# EAGLE schematic picotouchsynth (EAGLE 9.6.2)
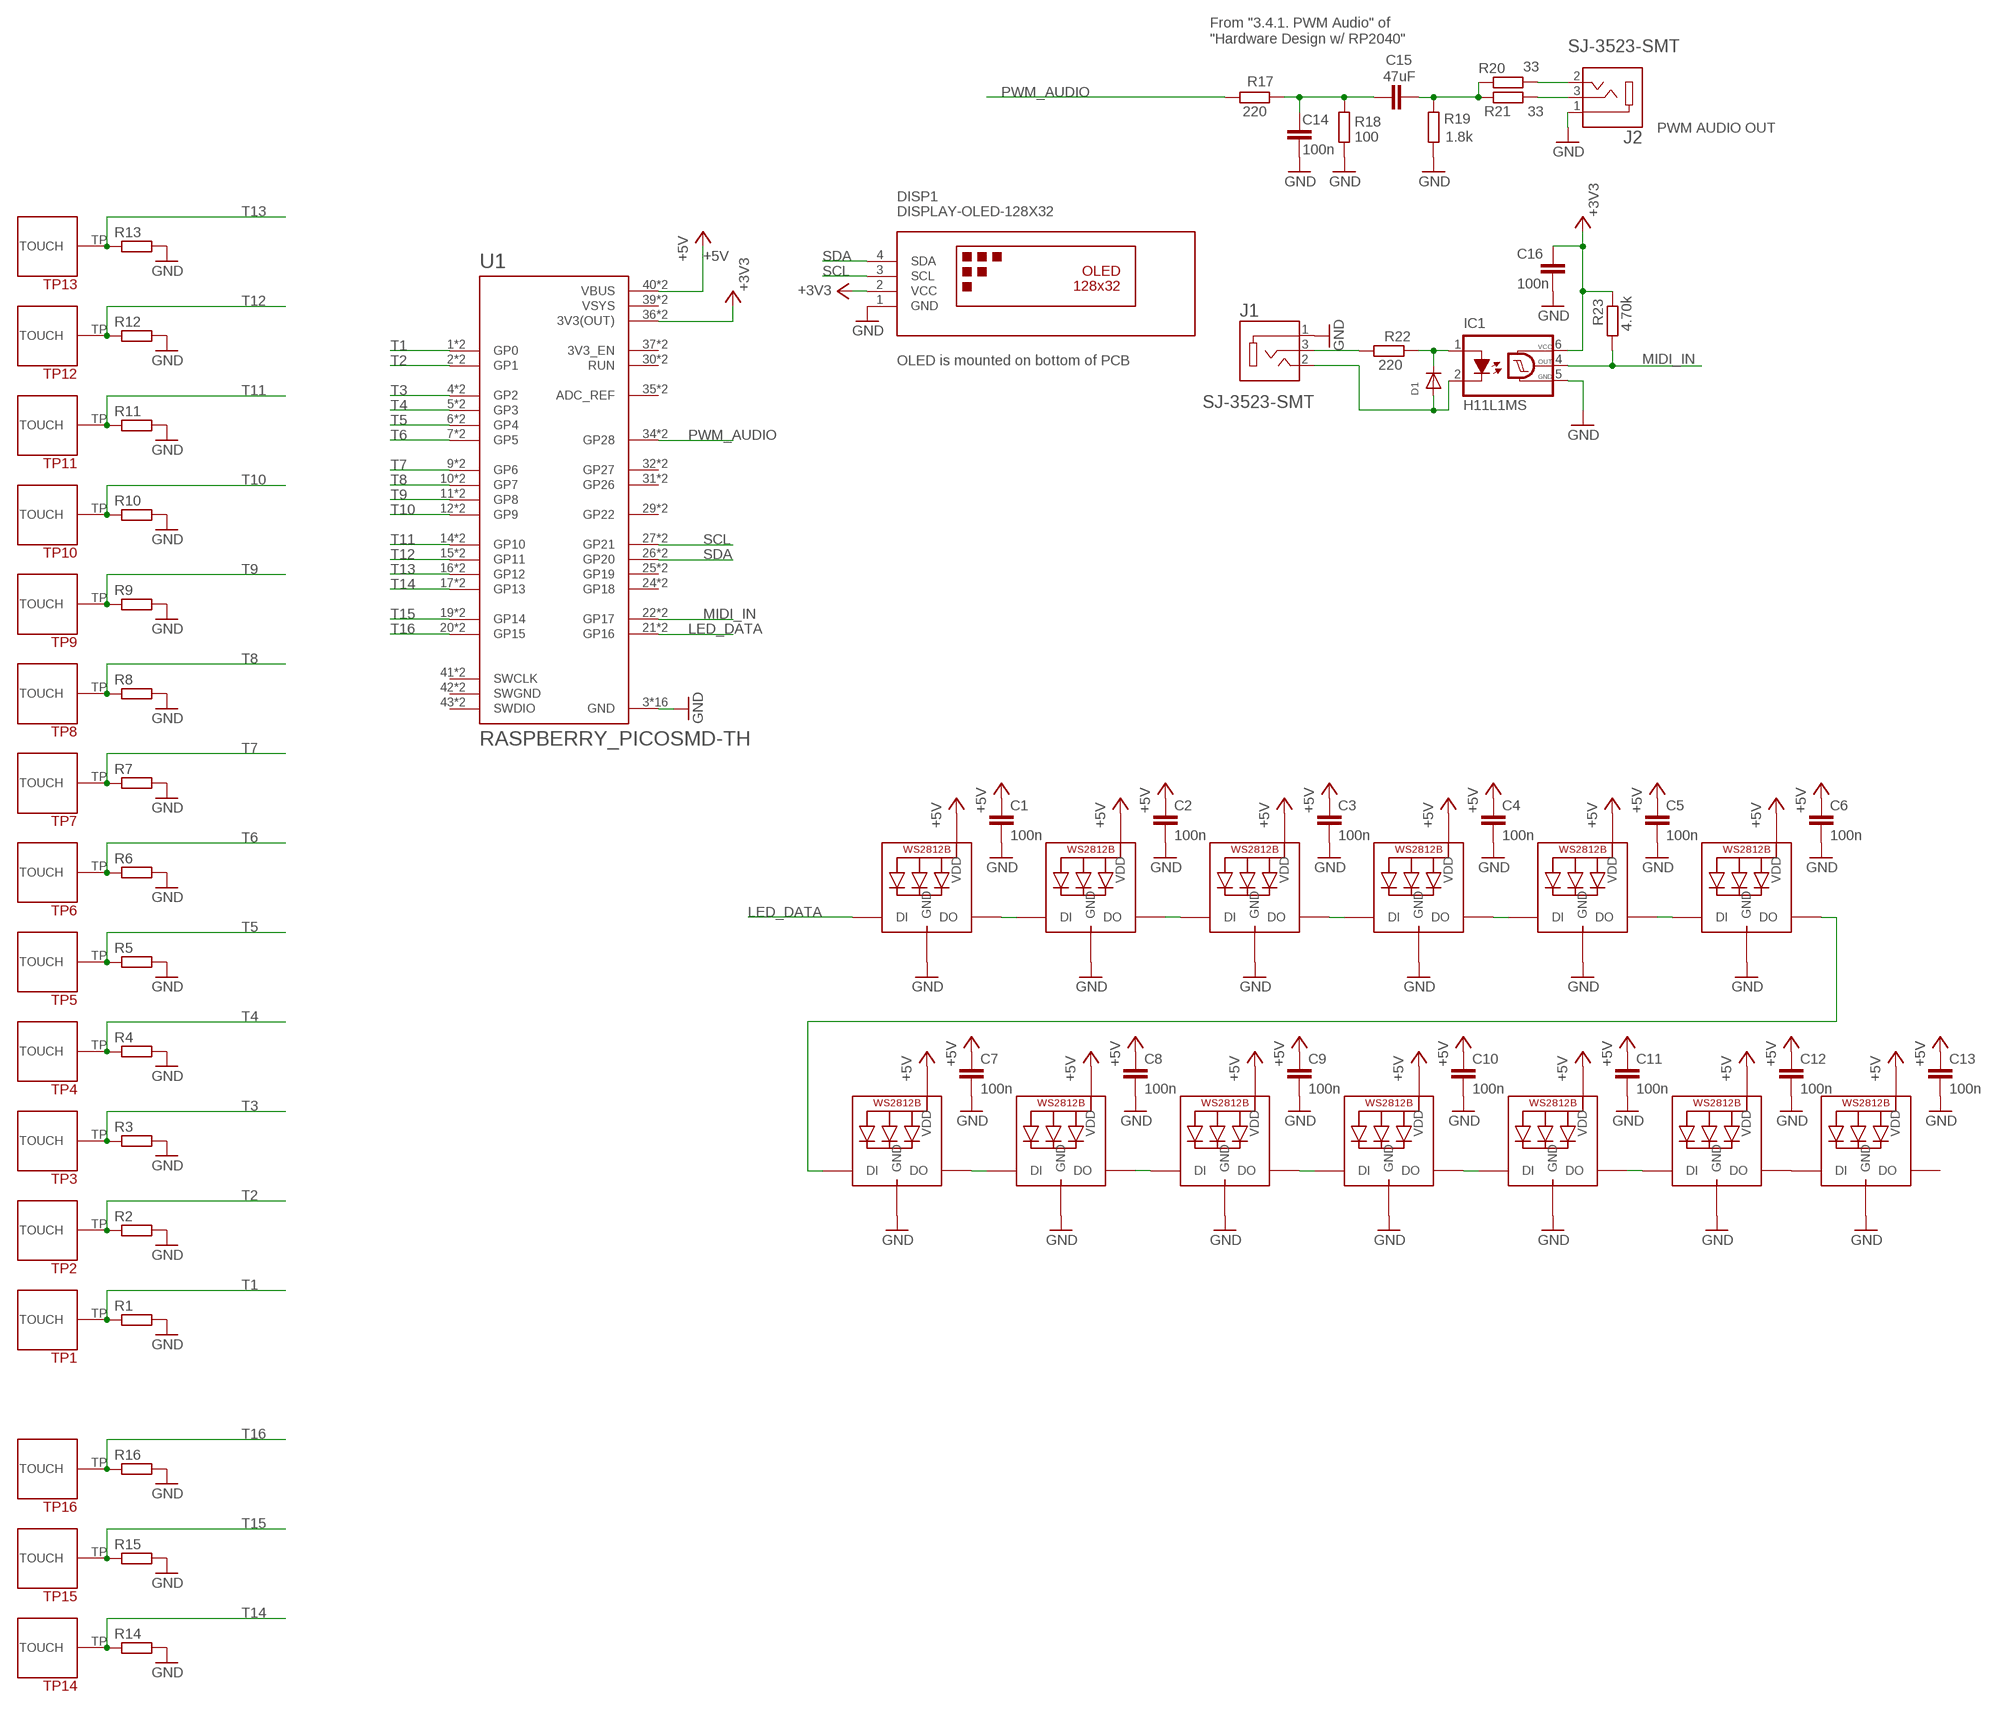
[diagram p0: schematic, sheet 1]

## Parts
C1  100n  C-EUC0805  [C0805]
C2  100n  C-EUC0805  [C0805]
C3  100n  C-EUC0805  [C0805]
C4  100n  C-EUC0805  [C0805]
C5  100n  C-EUC0805  [C0805]
C6  100n  C-EUC0805  [C0805]
C7  100n  C-EUC0805  [C0805]
C8  100n  C-EUC0805  [C0805]
C9  100n  C-EUC0805  [C0805]
C10  100n  C-EUC0805  [C0805]
C11  100n  C-EUC0805  [C0805]
C12  100n  C-EUC0805  [C0805]
C13  100n  C-EUC0805  [C0805]
C14  100n  C-EUC0805  [C0805]
C15  47uF  C-EUC0805  [C0805]
C16  100n  C-EUC0805  [C0805]
D1  DIODESOD-523  [SOD-523]
DISP1  DISPLAY-OLED-128X32  [DISPLAY-OLED-128X32]
IC1  H11L1MS  [DIL6-SMD]
J1  SJ-3523-SMT  [CUI_SJ-3523-SMT]
J2  SJ-3523-SMT  [CUI_SJ-3523-SMT]
LED1  MICROBUILDER_WS2812B_SK6812E  [MICROBUILDER_NEO3535_REVERSE]
LED2  MICROBUILDER_WS2812B_SK6812E  [MICROBUILDER_NEO3535_REVERSE]
LED3  MICROBUILDER_WS2812B_SK6812E  [MICROBUILDER_NEO3535_REVERSE]
LED4  MICROBUILDER_WS2812B_SK6812E  [MICROBUILDER_NEO3535_REVERSE]
LED5  MICROBUILDER_WS2812B_SK6812E  [MICROBUILDER_NEO3535_REVERSE]
LED6  MICROBUILDER_WS2812B_SK6812E  [MICROBUILDER_NEO3535_REVERSE]
LED7  MICROBUILDER_WS2812B_SK6812E  [MICROBUILDER_NEO3535_REVERSE]
LED8  MICROBUILDER_WS2812B_SK6812E  [MICROBUILDER_NEO3535_REVERSE]
LED9  MICROBUILDER_WS2812B_SK6812E  [MICROBUILDER_NEO3535_REVERSE]
LED10  MICROBUILDER_WS2812B_SK6812E  [MICROBUILDER_NEO3535_REVERSE]
LED11  MICROBUILDER_WS2812B_SK6812E  [MICROBUILDER_NEO3535_REVERSE]
LED12  MICROBUILDER_WS2812B_SK6812E  [MICROBUILDER_NEO3535_REVERSE]
LED13  MICROBUILDER_WS2812B_SK6812E  [MICROBUILDER_NEO3535_REVERSE]
R1  R-EU_R0805  [R0805]
R2  R-EU_R0805  [R0805]
R3  R-EU_R0805  [R0805]
R4  R-EU_R0805  [R0805]
R5  R-EU_R0805  [R0805]
R6  R-EU_R0805  [R0805]
R7  R-EU_R0805  [R0805]
R8  R-EU_R0805  [R0805]
R9  R-EU_R0805  [R0805]
R10  R-EU_R0805  [R0805]
R11  R-EU_R0805  [R0805]
R12  R-EU_R0805  [R0805]
R13  R-EU_R0805  [R0805]
R14  R-EU_R0805  [R0805]
R15  R-EU_R0805  [R0805]
R16  R-EU_R0805  [R0805]
R17  220  R-EU_R0805  [R0805]
R18  100  R-EU_R0805  [R0805]
R19  1.8k  R-EU_R0805  [R0805]
R20  33  R-EU_R0805  [R0805]
R21  33  R-EU_R0805  [R0805]
R22  220  R-EU_R0805  [R0805]
R23  4.70k  R-EU_R0805  [R0805]
TP1  TOUCHPADA  [TOUCHPADA]
TP2  TOUCHPADA  [TOUCHPADA]
TP3  TOUCHPADA  [TOUCHPADA]
TP4  TOUCHPADA  [TOUCHPADA]
TP5  TOUCHPADA  [TOUCHPADA]
TP6  TOUCHPADA  [TOUCHPADA]
TP7  TOUCHPADA  [TOUCHPADA]
TP8  TOUCHPADA  [TOUCHPADA]
TP9  TOUCHPADA  [TOUCHPADA]
TP10  TOUCHPADA  [TOUCHPADA]
TP11  TOUCHPADA  [TOUCHPADA]
TP12  TOUCHPADA  [TOUCHPADA]
TP13  TOUCHPADA  [TOUCHPADA]
TP14  TOUCHPADB  [TOUCHPADB]
TP15  TOUCHPADB  [TOUCHPADB]
TP16  TOUCHPADB  [TOUCHPADB]
U1  RASPBERRY_PICOSMD-TH  [PICO-PKG]

## Nets
+3V3: C16.1 DISP1.2(VCC) IC1.6(VCC) R23.1 U1.36(3V3(OUT)) U1.P$36(3V3(OUT))
+5V: C1.1 C2.1 C3.1 C4.1 C5.1 C6.1 C7.1 C8.1 C9.1 C10.1 C11.1 C12.1 C13.1 LED1.1-VDD(VDD) LED2.1-VDD(VDD) LED3.1-VDD(VDD) LED4.1-VDD(VDD) LED5.1-VDD(VDD) LED6.1-VDD(VDD) LED7.1-VDD(VDD) LED8.1-VDD(VDD) LED9.1-VDD(VDD) LED10.1-VDD(VDD) LED11.1-VDD(VDD) LED12.1-VDD(VDD) LED13.1-VDD(VDD) U1.40(VBUS) U1.P$40(VBUS)
GND: C1.2 C2.2 C3.2 C4.2 C5.2 C6.2 C7.2 C8.2 C9.2 C10.2 C11.2 C12.2 C13.2 C14.2 C16.2 DISP1.1(GND) IC1.5(GND) J1.1 J2.1 LED1.3-GND(GND) LED2.3-GND(GND) LED3.3-GND(GND) LED4.3-GND(GND) LED5.3-GND(GND) LED6.3-GND(GND) LED7.3-GND(GND) LED8.3-GND(GND) LED9.3-GND(GND) LED10.3-GND(GND) LED11.3-GND(GND) LED12.3-GND(GND) LED13.3-GND(GND) R1.2 R2.2 R3.2 R4.2 R5.2 R6.2 R7.2 R8.2 R9.2 R10.2 R11.2 R12.2 R13.2 R14.2 R15.2 R16.2 R18.1 R19.2 U1.3(GND) U1.8(GND) U1.13(GND) U1.18(GND) U1.23(GND) U1.28(GND) U1.33(GND) U1.38(GND) U1.P$3(GND) U1.P$8(GND) U1.P$13(GND) U1.P$18(GND) U1.P$23(GND) U1.P$28(GND) U1.P$33(GND) U1.P$38(GND)
LED_DATA: LED1.4-DIN(DI) U1.21(GP16) U1.P$21(GP16)
MIDI_IN: IC1.4(OUT) R23.2 U1.22(GP17) U1.P$22(GP17)
N$1: LED1.2-DOUT(DO) LED2.4-DIN(DI)
N$2: LED2.2-DOUT(DO) LED3.4-DIN(DI)
N$3: LED4.2-DOUT(DO) LED5.4-DIN(DI)
N$4: LED5.2-DOUT(DO) LED6.4-DIN(DI)
N$5: LED3.2-DOUT(DO) LED4.4-DIN(DI)
N$6: LED7.2-DOUT(DO) LED8.4-DIN(DI)
N$7: LED8.2-DOUT(DO) LED9.4-DIN(DI)
N$8: LED10.2-DOUT(DO) LED11.4-DIN(DI)
N$9: LED11.2-DOUT(DO) LED12.4-DIN(DI)
N$10: LED9.2-DOUT(DO) LED10.4-DIN(DI)
N$11: LED6.2-DOUT(DO) LED7.4-DIN(DI)
N$12: LED12.2-DOUT(DO) LED13.4-DIN(DI)
N$13: D1.K(C) IC1.1(A) R22.1
N$14: D1.A IC1.2(C) J1.2
N$15: J1.3 R22.2
N$44: J2.2 R20.1
N$46: J2.3 R21.1
N$47: C15.2 R19.1 R20.2 R21.2
N$48: C14.1 C15.1 R17.1 R18.2
PWM_AUDIO: R17.2 U1.34(GP28) U1.P$34(GP28)
SCL: DISP1.3(SCL) U1.27(GP21) U1.P$27(GP21)
SDA: DISP1.4(SDA) U1.26(GP20) U1.P$26(GP20)
T1: R1.1 TP1.TP(TOUCH) U1.1(GP0) U1.P$1(GP0)
T2: R2.1 TP2.TP(TOUCH) U1.2(GP1) U1.P$2(GP1)
T3: R3.1 TP3.TP(TOUCH) U1.4(GP2) U1.P$4(GP2)
T4: R4.1 TP4.TP(TOUCH) U1.5(GP3) U1.P$5(GP3)
T5: R5.1 TP5.TP(TOUCH) U1.6(GP4) U1.P$6(GP4)
T6: R6.1 TP6.TP(TOUCH) U1.7(GP5) U1.P$7(GP5)
T7: R7.1 TP7.TP(TOUCH) U1.9(GP6) U1.P$9(GP6)
T8: R8.1 TP8.TP(TOUCH) U1.10(GP7) U1.P$10(GP7)
T9: R9.1 TP9.TP(TOUCH) U1.11(GP8) U1.P$11(GP8)
T10: R10.1 TP10.TP(TOUCH) U1.12(GP9) U1.P$12(GP9)
T11: R11.1 TP11.TP(TOUCH) U1.14(GP10) U1.P$14(GP10)
T12: R12.1 TP12.TP(TOUCH) U1.15(GP11) U1.P$15(GP11)
T13: R13.1 TP13.TP(TOUCH) U1.16(GP12) U1.P$16(GP12)
T14: R14.1 TP14.TP(TOUCH) U1.17(GP13) U1.P$17(GP13)
T15: R15.1 TP15.TP(TOUCH) U1.19(GP14) U1.P$19(GP14)
T16: R16.1 TP16.TP(TOUCH) U1.20(GP15) U1.P$20(GP15)
Unconnected: LED13.2-DOUT(DO) U1.24(GP18) U1.25(GP19) U1.29(GP22) U1.30(RUN) U1.31(GP26) U1.32(GP27) U1.35(ADC_REF) U1.37(3V3_EN) U1.41(SWCLK) U1.43(SWDIO) U1.P$24(GP18) U1.P$25(GP19) U1.P$29(GP22) U1.P$30(RUN) U1.P$31(GP26) U1.P$32(GP27) U1.P$35(ADC_REF) U1.P$37(3V3_EN) U1.P$41(SWCLK) U1.P$43(SWDIO)

## Notes on the sheet
- From "3.4.1. PWM Audio" of
  "Hardware Design w/ RP2040"
- PWM AUDIO OUT
- OLED is mounted on bottom of PCB

## Power pins joined to a net without a drawn wire
SWGND: U1.42(SWGND) U1.P$42(SWGND)
VSYS: U1.39(VSYS) U1.P$39(VSYS)

## Library data of the parts
C1-C16 = rcl:C-EU: CAPACITOR, European symbol; SPICEPREFIX: C
D1 = adafruit:DIODE: Diode SMADIODE - SMA Surface Mount Package 20V 1A Schottky Diode Digikey: 641-1014-6-ND DO-1N4148 - Through Hole Small Current Diode SOD-123 20V 1 A (.5mV Vf) Schottky Diode - Digikey: MBRX120TPMSCT-ND SOD-323 10V 570mA (.38mV Vf, 3ns) Schottky Diode - Digikey: ZLLS410CT-ND SOD-523 30V 30mA Schottky Diode (RB751S-40TE61) - Digikey: RB751S-40TE61CT-ND SOT23-R/W - SOT23 Package (R = Solder Paste/Reflow Ovens, W = Hand-Soldering) BAT54Film 40V 300mA - Digikey: 497-7162-1-ND
DISP1 = diy-modules:DISPLAY-OLED-128X32: 128x32 Dot Matrix OLED Module with I2C interface based on SSD1306 chip More details available here: http://www.tinyosshop.com/index.php?route=product/product&product_id=953 Schematic available here: http://www.tinyosshop.com/datasheet/OLED%2012832.pdf SSD1306 datasheet: https://cdn-shop.adafruit.com/datasheets/SSD1306.pdf Click here to find device on ebay.com <http://www.ebay.com/sch/oled+display+128x32+i2c>
IC1 = optocoupler:H11L*M: 6-Pin DIP Optocoupler Source: http://www.fairchildsemi.com/ds/H1/H11L2-M.pdf; OC_FARNELL: unknown; OC_NEWARK: unknown
J1 J2 = SJ-3523-SMT:SJ-3523-SMT: Audio Jack Connector 3.5 mm Low Profile Surface Mount Stereo Jack, 3 Pin Right-Angle; CUI_PURCHASE_URL: https://www.cuidevices.com/product/interconnect/connectors/audio-connectors/jacks/sj-352x-smt-series?utm_source=snapeda.com&utm_medium=referral&utm_campaign=snapedaBOM; DESCRIPTION: 3.5 mm, Stereo, Right Angle, Surface Mount (SMT), 3 Conductors, 0~1 Internal Switches, Audio Jack Connector; DIGI-KEY_PART_NUMBER: CP-3523SJCT-ND; MF: CUI Devices; MP: SJ-3523-SMT-TR; PACKAGE: None; PURCHASE-URL: https://pricing.snapeda.com/search/part/SJ-3523-SMT-TR/?ref=eda
LED1-LED13 = Adafruit MacroPad 2040:MICROBUILDER_WS2812B
R1-R23 = rcl:R-EU_: RESISTOR, European symbol; SPICEPREFIX: R
TP1-TP16 = todstuff:TOUCHPAD
U1 = RpiPico:RASPBERRY_PICO: Raspberry Pi Pico